# EAGLE design audio_hat (EAGLE 9.3.2)
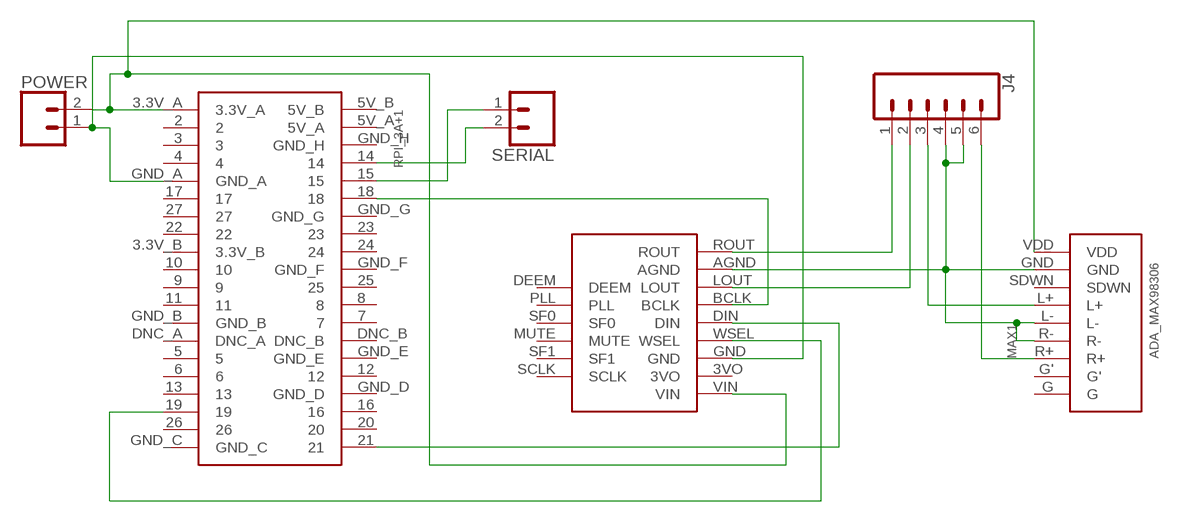
[diagram p0: schematic, sheet 1]

## Parts
J4  CONN_06NO_SILK_NO_POP  [1X06_NO_SILK]
MAX1  ADA_MAX98306  [ADA_MAX98306]
POWER  CONN_02  [1X02]
RPI_3A+1  RPI_3A+  [RPI_3A+]
SERIAL  CONN_02  [1X02]
UDA1  ADA_UDA1334  [ADA_UDA1334]

## Nets
N$1: RPI_3A+1.19 UDA1.WSEL
N$2: POWER.1 RPI_3A+1.GND_A UDA1.GND
N$3: MAX1.VDD POWER.2 RPI_3A+1.3.3V_A UDA1.VIN
N$4: RPI_3A+1.21 UDA1.DIN
N$5: J4.1 UDA1.ROUT
N$6: J4.2 UDA1.LOUT
N$7: J4.4 J4.5 MAX1.GND MAX1.L- MAX1.R- UDA1.AGND
N$8: J4.3 MAX1.L+
N$9: RPI_3A+1.14 SERIAL.2
N$10: J4.6 MAX1.R+
N$11: RPI_3A+1.15 SERIAL.1
N$12: RPI_3A+1.18 UDA1.BCLK
Unconnected: MAX1.G MAX1.G' MAX1.SDWN RPI_3A+1.2 RPI_3A+1.3 RPI_3A+1.3.3V_B RPI_3A+1.4 RPI_3A+1.5 RPI_3A+1.5V_A RPI_3A+1.5V_B RPI_3A+1.6 RPI_3A+1.7 RPI_3A+1.8 RPI_3A+1.9 RPI_3A+1.10 RPI_3A+1.11 RPI_3A+1.12 RPI_3A+1.13 RPI_3A+1.16 RPI_3A+1.17 RPI_3A+1.20 RPI_3A+1.22 RPI_3A+1.23 RPI_3A+1.24 RPI_3A+1.25 RPI_3A+1.26 RPI_3A+1.27 RPI_3A+1.DNC_A RPI_3A+1.DNC_B RPI_3A+1.GND_B RPI_3A+1.GND_C RPI_3A+1.GND_D RPI_3A+1.GND_E RPI_3A+1.GND_F RPI_3A+1.GND_G RPI_3A+1.GND_H UDA1.3VO UDA1.DEEM UDA1.MUTE UDA1.PLL UDA1.SCLK UDA1.SF0 UDA1.SF1

## Library data of the parts
J4 = SparkFun-Connectors:CONN_06: Multi connection point. Often used as Generic Header-pin footprint for 0.1 inch spaced/style header connections On any of the 0.1 inch spaced packages, you can populate with these: Break Away Headers - Straight <https://www.sparkfun.com/products/116> (PRT-00116) Break Away Male Headers - Right Angle <https://www.sparkfun.com/products/553> (PRT-00553) Female Headers <https://www.sparkfun.com/products/115> (PRT-00115) Break Away Headers - Machine Pin <https://www.sparkfun.com/products/117> (PRT-00117) Break Away Female Headers - Swiss Machine Pin <https://www.sparkfun.com/products/743> (PRT-00743) Arduino Stackable Header - 6 Pin <https://www.sparkfun.com/products/9280> (PRT-09280) For SCREWTERMINALS and SPRING TERMINALS visit here: Screw Terimnals on SparkFun.com <https://www.sparkfun.com/search/results?term=Screw+Terminals> (5mm/3.5mm/2.54mm spacing) This device is also useful as a general connection point to wire up your design to another part of your project. Our various solder wires solder well into these plated through hole pads. Hook-Up Wire - Assortment (Stranded, 22 AWG) <https://www.sparkfun.com/products/11375> (PRT-11375) Hook-Up Wire - Assortment (Solid Core, 22 AWG) <https://www.sparkfun.com/products/11367> (PRT-11367) View the entire wire category on our website here <https://www.sparkfun.com/categories/141>
MAX1 = my_library:ADA_MAX98306
POWER SERIAL = SparkFun-Connectors:CONN_02: Multi connection point. Often used as Generic Header-pin footprint for 0.1 inch spaced/style header connections On any of the 0.1 inch spaced packages, you can populate with these: Break Away Headers - Straight <https://www.sparkfun.com/products/116> (PRT-00116) Break Away Male Headers - Right Angle <https://www.sparkfun.com/products/553> (PRT-00553) Female Headers <https://www.sparkfun.com/products/115> (PRT-00115) Break Away Headers - Machine Pin <https://www.sparkfun.com/products/117> (PRT-00117) Break Away Female Headers - Swiss Machine Pin <https://www.sparkfun.com/products/743> (PRT-00743) For SCREWTERMINALS and SPRING TERMINALS visit here: Screw Terimnals on SparkFun.com <https://www.sparkfun.com/search/results?term=Screw+Terminals> (5mm/3.5mm/2.54mm spacing) This device is also useful as a general connection point to wire up your design to another part of your project. Our various solder wires solder well into these plated through hole pads. Hook-Up Wire - Assortment (Stranded, 22 AWG) <https://www.sparkfun.com/products/11375> (PRT-11375) Hook-Up Wire - Assortment (Solid Core, 22 AWG) <https://www.sparkfun.com/products/11367> (PRT-11367) View the entire wire category on our website here <https://www.sparkfun.com/categories/141> Special notes: Molex polarized connector foot print use with: PRT-08233 with associated crimp pins and housings. 2.54_SCREWTERM for use with PRT-10571. 3.5mm Screw Terminal footprints for PRT-08084 5mm Screw Terminal footprints for use with PRT-08432
RPI_3A+1 = my_library:RPI_3A+
UDA1 = my_library:ADA_UDA1334

## Board
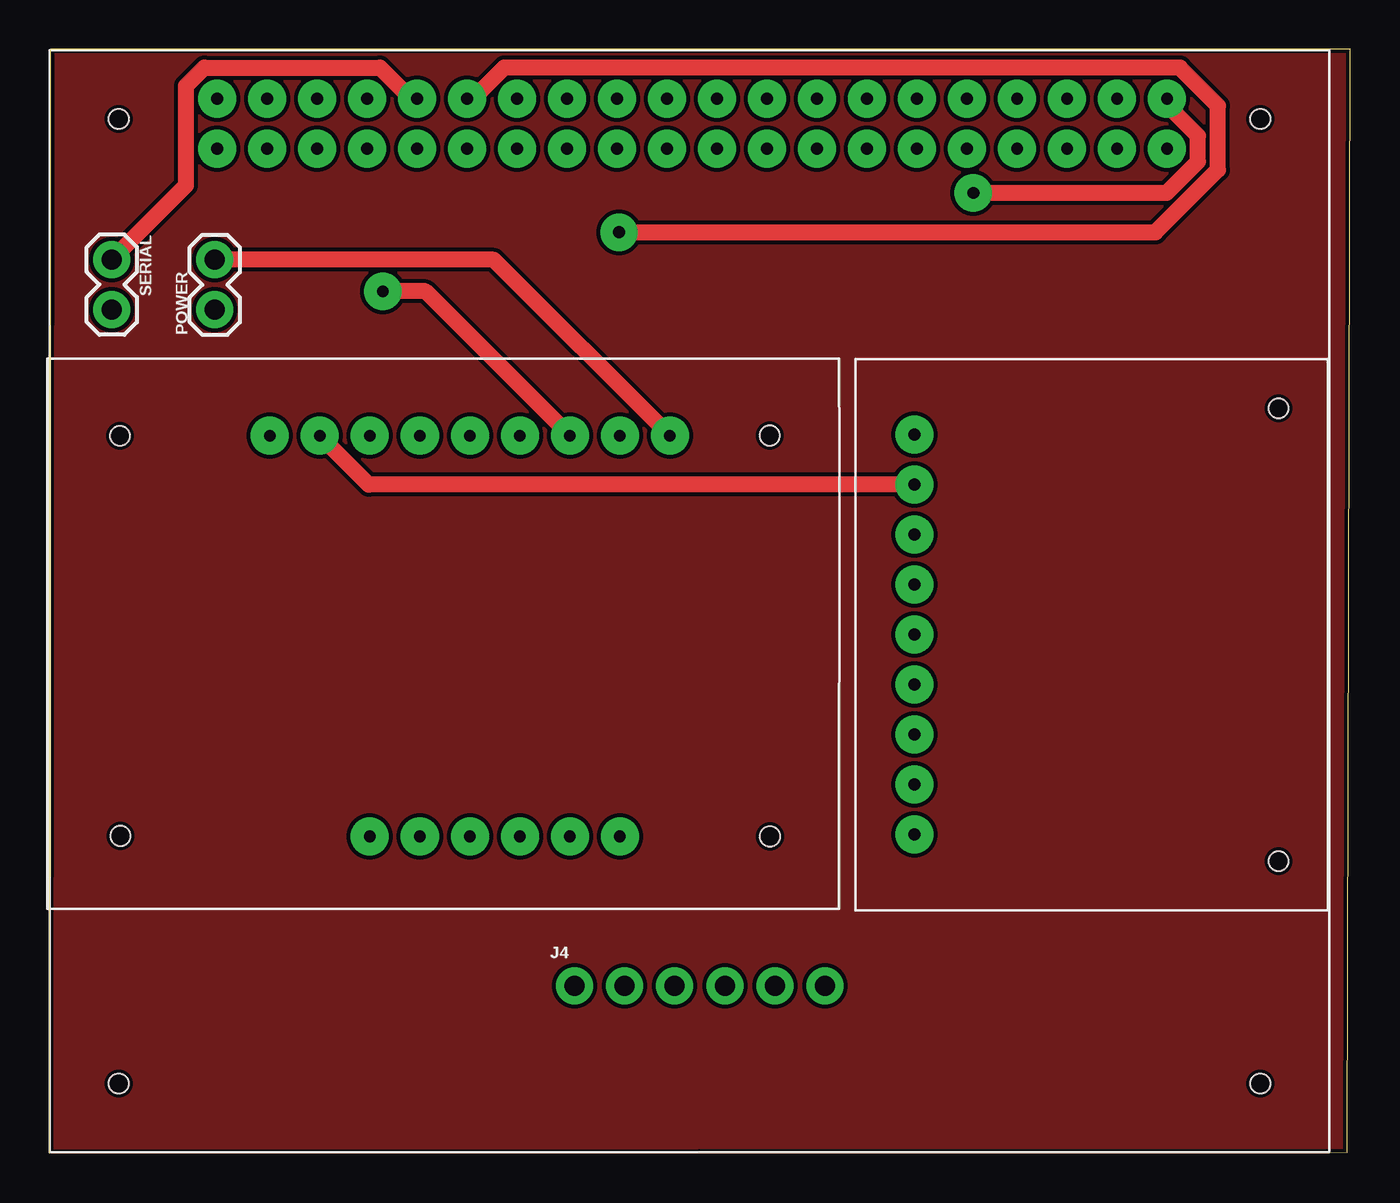
[diagram p1: board, top side]
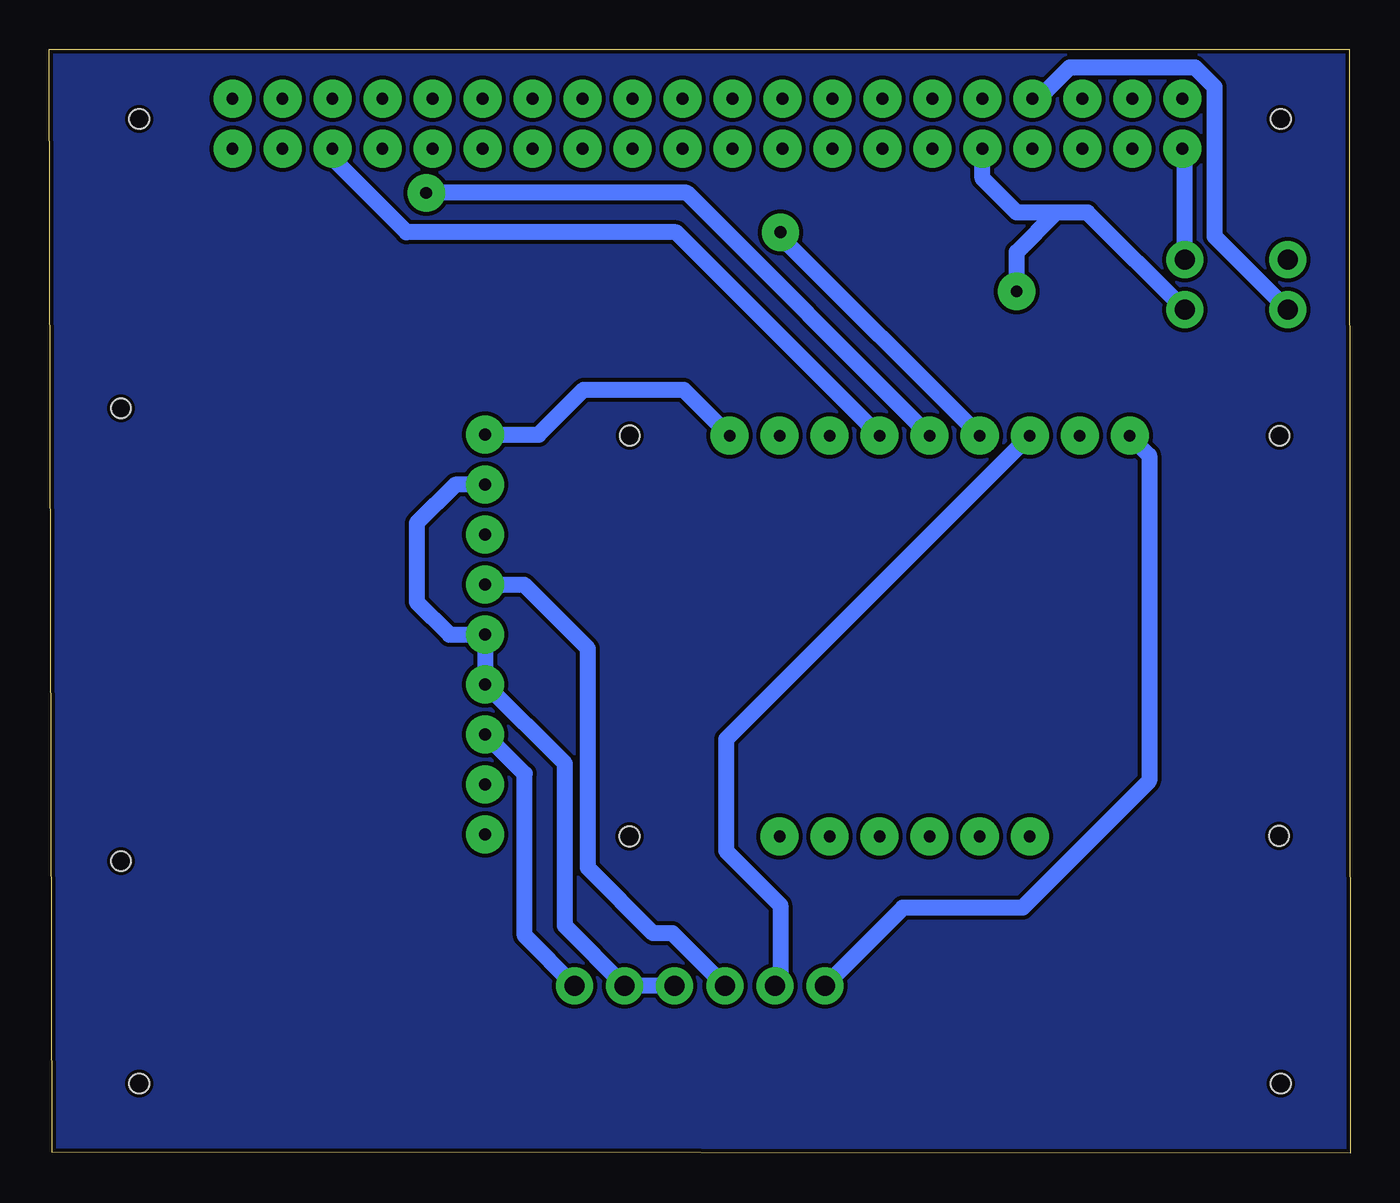
[diagram p2: board, bottom side, seen from below]

Size 66.1 x 56.1 mm. Coordinates in mm from the lower left corner, seen from the top.
Outline: 0,0 65.95,0.05 66.1,56.1 0.05,56.1 0,0
Copper layers (1*16): Top 0.035mm / dielectric 1.5mm / Bottom 0.035mm
Design rules "SparkFun": minimum track width 8mil, minimum drill 20mil, track to track 8mil, track to pad 8mil, pad to pad 8mil, via to via 8mil, smd to smd 8mil, copper to edge 8mil, drill to drill 8mil, minimum pad ring 12mil, minimum via ring 10mil, stop-mask expansion 4mil, vias tented up to drill 20mil, thermal gap 10mil

### Footprints (pad centres in the part's own frame; a part is rotated, then mirrored left to right if it is on the bottom)
1X06_NO_SILK = drill 1.016 pad 1.88: 1 0,0; 2 2.54,0; 3 5.08,0; 4 7.62,0; 5 10.16,0; 6 12.7,0
ADA_MAX98306 = drill 0.6 pad 1.93: G -10.15,0; G' -7.61,0; GND 7.63,0; L+ 2.55,0; L- 0.01,0; R+ -5.07,0; R- -2.53,0; SDWN 5.09,0; VDD 10.17,0 | hole 1: -11.5,-18.5; 11.5,-18.5
1X02 = drill 1.016 pad 1.88: 1 0,0; 2 2.54,0
RPI_3A+ = drill 0.6 pad 1.93: 2 11.04,-5; 3 13.58,-5; 3.3V_A 8.5,-5; 3.3V_B 28.82,-5; 4 16.12,-5; 5 44.06,-5; 5V_A 11.04,-2.46; 5V_B 8.5,-2.46; 6 46.6,-5; 7 38.98,-2.46; 8 36.44,-2.46; 9 33.9,-5; 10 31.36,-5; 11 36.44,-5; 12 46.6,-2.46; 13 49.14,-5; 14 16.12,-2.46; 15 18.66,-2.46; 16 51.68,-2.46; 17 21.2,-5; 18 21.2,-2.46; 19 51.68,-5; 20 54.22,-2.46; 21 56.76,-2.46; 22 26.28,-5; 23 26.28,-2.46; 24 28.82,-2.46; 25 33.9,-2.46; 26 54.22,-5; 27 23.74,-5; DNC_A 41.52,-5; DNC_B 41.52,-2.46; GND_A 18.66,-5; GND_B 38.98,-5; GND_C 56.76,-5; GND_D 49.14,-2.46; GND_E 44.06,-2.46; GND_F 31.36,-2.46; GND_G 23.74,-2.46; GND_H 13.58,-2.46 | hole 1: 3.5,-3.5; 61.5,-3.5; 3.5,-52.5; 61.5,-52.5
ADA_UDA1334 = drill 0.6 pad 1.93: 3VO 11.04,-21; AGND 26.28,-21; BCLK 21.2,-21; DEEM 23.74,-0.647; DIN 18.66,-21; GND 13.58,-21; LOUT 23.74,-21; MUTE 16.12,-0.647; PLL 21.2,-0.647; ROUT 28.82,-21; SCLK 11.04,-0.647; SF0 18.66,-0.647; SF1 13.58,-0.647; VIN 8.5,-21; WSEL 16.12,-21 | hole 1: 3.414,-0.646; 36.413,-0.671; 3.432,-21.006; 36.438,-21.001

### Placement (x,y rotation side)
J4  26.7,8.52 0 top
MAX1  43.95,26.35 90 top
POWER  8.42,42.86 90 top
RPI_3A+1  0.03,56.05 0 top
SERIAL  3.18,45.41 270 top
UDA1  40.03,15.46 180 top

### Tracks (layer width: path | path; a pad name or v marks a point on that pad's centre or on a via)
GND
  pour Bottom: 0,56.05 0,-0.05 66,-0.05 66,56.05
  pour Top: -0.05,56.05 -0.05,-0.05 66,-0.05 66,56.05
N$1
  Bottom 0.813: UDA1.WSEL 34.25,46.8 47.95,46.8 51.71,50.56 RPI_3A+1.19
N$2  (via drill 0.6 pad 1.9)
  Top 0.813: UDA1.GND 19.11,43.8 v16.95,43.8
  Bottom 0.813: POWER.1 13.35,47.8 14.95,47.8 | 14.95,47.8 16.95,47.8 18.69,49.54 RPI_3A+1.GND_A | v16.95,43.8 16.95,45.8 14.95,47.8
N$3
  Top 0.813: UDA1.VIN 22.59,45.4 POWER.2
  Bottom 0.813: POWER.2 8.42,50.94 RPI_3A+1.3.3V_A | MAX1.VDD 41.23,36.52 38.95,38.8 33.87,38.8 UDA1.VIN
N$4  (via drill 0.6 pad 1.9)
  Top 0.813: RPI_3A+1.21 56.79,53.28 58.37,51.7 58.37,50.4 56.77,48.8 v46.95,48.8
  Bottom 0.813: UDA1.DIN 33.71,48.8 v46.95,48.8
N$5
  Bottom 0.813: J4.1 22.74,12.48 16.66,12.48 10.21,18.93 10.21,35.46 UDA1.ROUT
N$6
  Bottom 0.813: UDA1.LOUT 31.71,21.04 31.71,15.38 28.95,12.61 28.95,8.81 J4.2
N$7
  Top 0.813: MAX1.GND 16.23,33.98 UDA1.AGND
  Bottom 0.813: MAX1.GND 45.47,33.98 47.42,32.02 47.42,28.02 45.77,26.36 MAX1.L- MAX1.R- 43.92,23.82 39.9,19.8 39.9,11.56 J4.5 J4.4
N$8
  Bottom 0.813: J4.3 34.44,11.18 35.41,11.18 38.73,14.51 38.73,25.65 41.98,28.9 MAX1.L+
N$9
  Bottom 0.813: SERIAL.2 6.89,46.58 6.89,54.18 7.88,55.16 14.26,55.16 15.84,53.59 RPI_3A+1.14
N$10
  Bottom 0.813: J4.6 41.95,11.07 41.95,19.28 MAX1.R+
N$11
  Top 0.813: SERIAL.1 6.96,49.19 6.96,54.24 7.88,55.16 16.8,55.16 18.38,53.59 RPI_3A+1.15
N$12  (via drill 0.6 pad 1.9)
  Top 0.813: v28.95,46.8 56.2,46.8 59.38,49.98 59.38,53.23 57.44,55.16 23.12,55.16 21.54,53.59 RPI_3A+1.18
  Bottom 0.813: UDA1.BCLK 28.95,46.58 v28.95,46.8